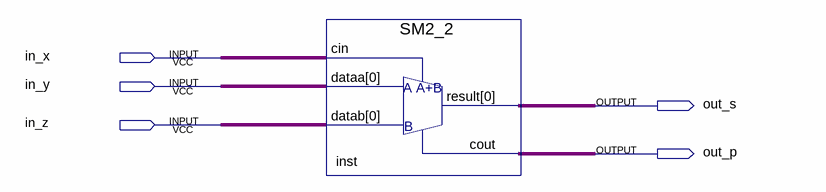
[diagram p0: schematic sheet]
// Quartus schematic KS_Lab2_SM.bdf as structural Verilog: 1 symbols, 5 pins
module KS_Lab2_SM (
  input  in_x,
  input  in_y,
  input  in_z,
  output out_s,
  output out_p
);

  SM2_2 inst (.cin(in_x), .dataa(in_y), .datab(in_z), .result(out_s), .cout(out_p));
endmodule
